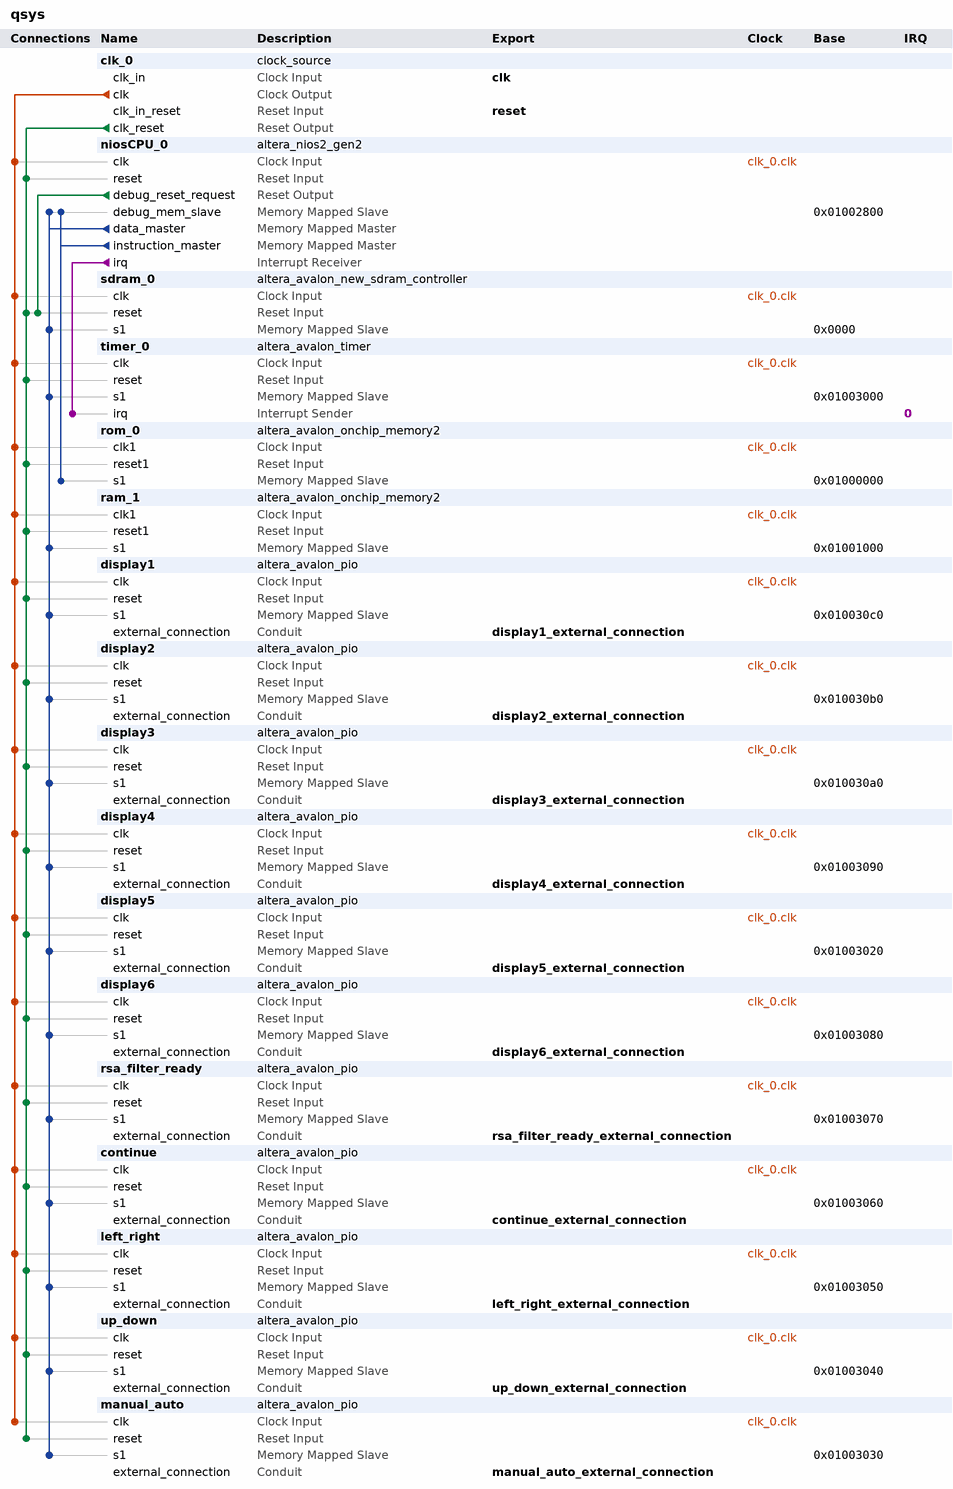
[diagram p0: system contents]
# Platform Designer (Qsys) system qsys, Cyclone V 5CSEMA5F31C6
# Parameters at their usual value, and those the tool derives, are not listed.
package require -exact qsys 20.1
create_system qsys
set_project_property DEVICE_FAMILY {Cyclone V}
set_project_property DEVICE 5CSEMA5F31C6

add_instance clk_0 clock_source 20.1
set_instance_parameter_value clk_0 clockFrequency 50000000

add_instance niosCPU_0 altera_nios2_gen2 20.1
set_instance_parameter_value niosCPU_0 dcache_size 2048
set_instance_parameter_value niosCPU_0 exceptionSlave rom_0.s1
set_instance_parameter_value niosCPU_0 icache_size 4096
set_instance_parameter_value niosCPU_0 impl Tiny
set_instance_parameter_value niosCPU_0 resetSlave rom_0.s1

add_instance sdram_0 altera_avalon_new_sdram_controller 20.1
set_instance_parameter_value sdram_0 TAC 5.5
set_instance_parameter_value sdram_0 TRCD 20.0
set_instance_parameter_value sdram_0 TRP 20.0
set_instance_parameter_value sdram_0 casLatency 3
set_instance_parameter_value sdram_0 columnWidth 8
set_instance_parameter_value sdram_0 dataWidth 32
set_instance_parameter_value sdram_0 generateSimulationModel false
set_instance_parameter_value sdram_0 model single_Micron_MT48LC4M32B2_7_chip
set_instance_parameter_value sdram_0 numberOfBanks 4
set_instance_parameter_value sdram_0 numberOfChipSelects 1
set_instance_parameter_value sdram_0 powerUpDelay 100.0
set_instance_parameter_value sdram_0 refreshPeriod 15.625
set_instance_parameter_value sdram_0 rowWidth 12

add_instance timer_0 altera_avalon_timer 20.1
set_instance_parameter_value timer_0 alwaysRun true
set_instance_parameter_value timer_0 fixedPeriod true
set_instance_parameter_value timer_0 period 1
set_instance_parameter_value timer_0 periodUnits SEC
set_instance_parameter_value timer_0 snapshot false

add_instance rom_0 altera_avalon_onchip_memory2 20.1
set_instance_parameter_value rom_0 dataWidth 32
set_instance_parameter_value rom_0 dualPort false
set_instance_parameter_value rom_0 initMemContent true
set_instance_parameter_value rom_0 initializationFileName onchip_mem.hex
set_instance_parameter_value rom_0 memorySize 4096
set_instance_parameter_value rom_0 writable false

add_instance ram_1 altera_avalon_onchip_memory2 20.1
set_instance_parameter_value ram_1 dataWidth 32
set_instance_parameter_value ram_1 dualPort false
set_instance_parameter_value ram_1 initMemContent true
set_instance_parameter_value ram_1 initializationFileName onchip_mem.hex
set_instance_parameter_value ram_1 memorySize 4096

add_instance display1 altera_avalon_pio 20.1
set_instance_parameter_value display1 direction Output
set_instance_parameter_value display1 width 7

add_instance display2 altera_avalon_pio 20.1
set_instance_parameter_value display2 direction Output
set_instance_parameter_value display2 width 7

add_instance display3 altera_avalon_pio 20.1
set_instance_parameter_value display3 direction Output
set_instance_parameter_value display3 width 7

add_instance display4 altera_avalon_pio 20.1
set_instance_parameter_value display4 direction Output
set_instance_parameter_value display4 width 7

add_instance display5 altera_avalon_pio 20.1
set_instance_parameter_value display5 direction Output
set_instance_parameter_value display5 width 7

add_instance display6 altera_avalon_pio 20.1
set_instance_parameter_value display6 direction Output
set_instance_parameter_value display6 width 7

add_instance rsa_filter_ready altera_avalon_pio 20.1
set_instance_parameter_value rsa_filter_ready direction Output
set_instance_parameter_value rsa_filter_ready width 2

add_instance continue altera_avalon_pio 20.1
set_instance_parameter_value continue direction InOut
set_instance_parameter_value continue width 1

add_instance left_right altera_avalon_pio 20.1
set_instance_parameter_value left_right direction InOut
set_instance_parameter_value left_right width 2

add_instance up_down altera_avalon_pio 20.1
set_instance_parameter_value up_down direction InOut
set_instance_parameter_value up_down width 2

add_instance manual_auto altera_avalon_pio 20.1
set_instance_parameter_value manual_auto direction InOut
set_instance_parameter_value manual_auto width 1

# connections
add_connection clk_0.clk continue.clk clock
add_connection clk_0.clk display1.clk clock
add_connection clk_0.clk display2.clk clock
add_connection clk_0.clk display3.clk clock
add_connection clk_0.clk display4.clk clock
add_connection clk_0.clk display5.clk clock
add_connection clk_0.clk display6.clk clock
add_connection clk_0.clk left_right.clk clock
add_connection clk_0.clk manual_auto.clk clock
add_connection clk_0.clk niosCPU_0.clk clock
add_connection clk_0.clk ram_1.clk1 clock
add_connection clk_0.clk rom_0.clk1 clock
add_connection clk_0.clk rsa_filter_ready.clk clock
add_connection clk_0.clk sdram_0.clk clock
add_connection clk_0.clk timer_0.clk clock
add_connection clk_0.clk up_down.clk clock
add_connection clk_0.clk_reset continue.reset reset
add_connection clk_0.clk_reset display1.reset reset
add_connection clk_0.clk_reset display2.reset reset
add_connection clk_0.clk_reset display3.reset reset
add_connection clk_0.clk_reset display4.reset reset
add_connection clk_0.clk_reset display5.reset reset
add_connection clk_0.clk_reset display6.reset reset
add_connection clk_0.clk_reset left_right.reset reset
add_connection clk_0.clk_reset manual_auto.reset reset
add_connection clk_0.clk_reset niosCPU_0.reset reset
add_connection clk_0.clk_reset ram_1.reset1 reset
add_connection clk_0.clk_reset rom_0.reset1 reset
add_connection clk_0.clk_reset rsa_filter_ready.reset reset
add_connection clk_0.clk_reset sdram_0.reset reset
add_connection clk_0.clk_reset timer_0.reset reset
add_connection clk_0.clk_reset up_down.reset reset
add_connection niosCPU_0.debug_reset_request sdram_0.reset reset
add_connection niosCPU_0.data_master continue.s1 avalon
set_connection_parameter_value niosCPU_0.data_master/continue.s1 baseAddress 0x01003060
add_connection niosCPU_0.data_master display1.s1 avalon
set_connection_parameter_value niosCPU_0.data_master/display1.s1 baseAddress 0x010030c0
add_connection niosCPU_0.data_master display2.s1 avalon
set_connection_parameter_value niosCPU_0.data_master/display2.s1 baseAddress 0x010030b0
add_connection niosCPU_0.data_master display3.s1 avalon
set_connection_parameter_value niosCPU_0.data_master/display3.s1 baseAddress 0x010030a0
add_connection niosCPU_0.data_master display4.s1 avalon
set_connection_parameter_value niosCPU_0.data_master/display4.s1 baseAddress 0x01003090
add_connection niosCPU_0.data_master display5.s1 avalon
set_connection_parameter_value niosCPU_0.data_master/display5.s1 baseAddress 0x01003020
add_connection niosCPU_0.data_master display6.s1 avalon
set_connection_parameter_value niosCPU_0.data_master/display6.s1 baseAddress 0x01003080
add_connection niosCPU_0.data_master left_right.s1 avalon
set_connection_parameter_value niosCPU_0.data_master/left_right.s1 baseAddress 0x01003050
add_connection niosCPU_0.data_master manual_auto.s1 avalon
set_connection_parameter_value niosCPU_0.data_master/manual_auto.s1 baseAddress 0x01003030
add_connection niosCPU_0.data_master niosCPU_0.debug_mem_slave avalon
set_connection_parameter_value niosCPU_0.data_master/niosCPU_0.debug_mem_slave baseAddress 0x01002800
add_connection niosCPU_0.data_master ram_1.s1 avalon
set_connection_parameter_value niosCPU_0.data_master/ram_1.s1 baseAddress 0x01001000
add_connection niosCPU_0.data_master rsa_filter_ready.s1 avalon
set_connection_parameter_value niosCPU_0.data_master/rsa_filter_ready.s1 baseAddress 0x01003070
add_connection niosCPU_0.data_master sdram_0.s1 avalon
set_connection_parameter_value niosCPU_0.data_master/sdram_0.s1 baseAddress 0x0000
add_connection niosCPU_0.data_master timer_0.s1 avalon
set_connection_parameter_value niosCPU_0.data_master/timer_0.s1 baseAddress 0x01003000
add_connection niosCPU_0.data_master up_down.s1 avalon
set_connection_parameter_value niosCPU_0.data_master/up_down.s1 baseAddress 0x01003040
add_connection niosCPU_0.instruction_master niosCPU_0.debug_mem_slave avalon
set_connection_parameter_value niosCPU_0.instruction_master/niosCPU_0.debug_mem_slave baseAddress 0x01002800
add_connection niosCPU_0.instruction_master rom_0.s1 avalon
set_connection_parameter_value niosCPU_0.instruction_master/rom_0.s1 baseAddress 0x01000000
add_connection niosCPU_0.irq timer_0.irq interrupt
set_connection_parameter_value niosCPU_0.irq/timer_0.irq irqNumber 0

# exported interfaces
add_interface clk clock sink
set_interface_property clk EXPORT_OF clk_0.clk_in
add_interface continue_external_connection conduit end
set_interface_property continue_external_connection EXPORT_OF continue.external_connection
add_interface display1_external_connection conduit end
set_interface_property display1_external_connection EXPORT_OF display1.external_connection
add_interface display2_external_connection conduit end
set_interface_property display2_external_connection EXPORT_OF display2.external_connection
add_interface display3_external_connection conduit end
set_interface_property display3_external_connection EXPORT_OF display3.external_connection
add_interface display4_external_connection conduit end
set_interface_property display4_external_connection EXPORT_OF display4.external_connection
add_interface display5_external_connection conduit end
set_interface_property display5_external_connection EXPORT_OF display5.external_connection
add_interface display6_external_connection conduit end
set_interface_property display6_external_connection EXPORT_OF display6.external_connection
add_interface left_right_external_connection conduit end
set_interface_property left_right_external_connection EXPORT_OF left_right.external_connection
add_interface manual_auto_external_connection conduit end
set_interface_property manual_auto_external_connection EXPORT_OF manual_auto.external_connection
add_interface reset reset sink
set_interface_property reset EXPORT_OF clk_0.clk_in_reset
add_interface rsa_filter_ready_external_connection conduit end
set_interface_property rsa_filter_ready_external_connection EXPORT_OF rsa_filter_ready.external_connection
add_interface up_down_external_connection conduit end
set_interface_property up_down_external_connection EXPORT_OF up_down.external_connection

set_interconnect_requirement {$system} qsys_mm.clockCrossingAdapter HANDSHAKE
set_interconnect_requirement {$system} qsys_mm.enableEccProtection FALSE
set_interconnect_requirement {$system} qsys_mm.insertDefaultSlave FALSE
set_interconnect_requirement {$system} qsys_mm.maxAdditionalLatency 1

save_system qsys.qsys
